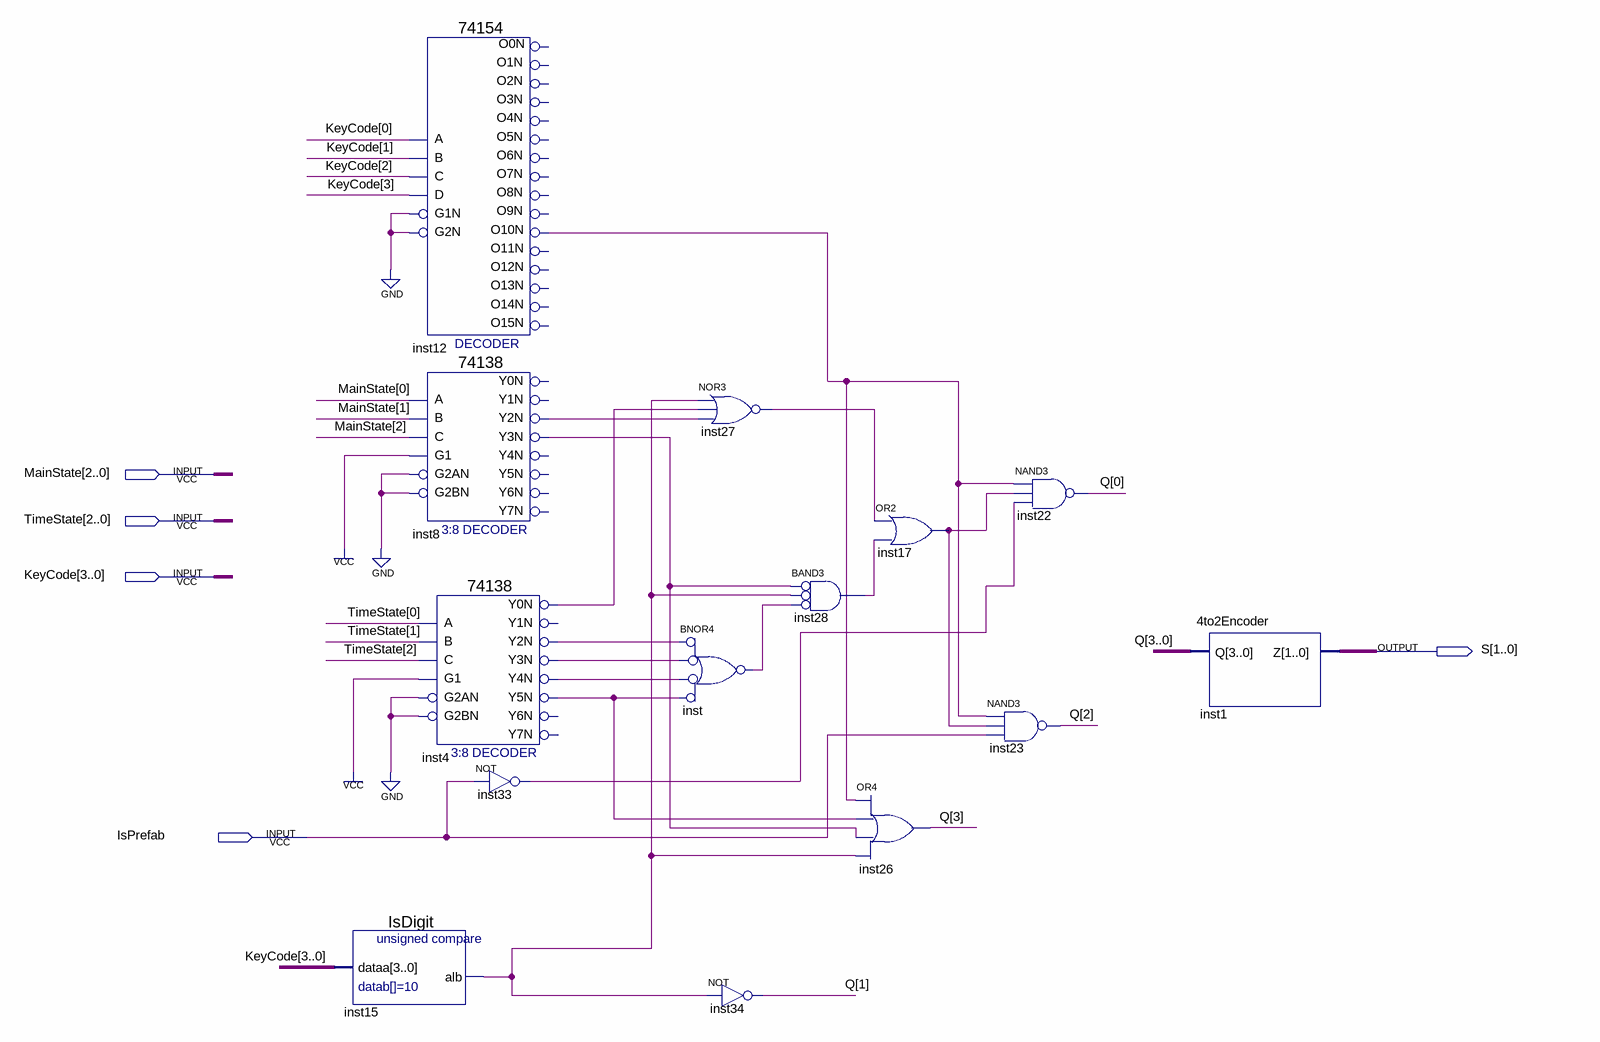
[diagram p0: schematic sheet]
// Quartus schematic TimeSourceSelector.bdf as structural Verilog: 14 symbols, 5 pins
module TimeSourceSelector (
  input  [2:0] MainState,
  input  [2:0] TimeState,
  input  [3:0] KeyCode,
  input  IsPrefab,
  output [1:0] S
);

  wire inst4_y0n, inst4_y2n, inst4_y3n, inst4_y4n, inst4_y5n, inst8_y2n, inst8_y3n, inst12_o10n, inst15_alb,
       inst17_out, inst27_out, inst28_out, inst33_out, inst_out;
  wire [3:0] Q;

  IsDigit inst15 (.dataa(KeyCode), .alb(inst15_alb));
  \74154  inst12 (
    .C(KeyCode[2]), .D(KeyCode[3]), .B(KeyCode[1]), .A(KeyCode[0]), .G1N(1'b0), .G2N(1'b0), .O10N(inst12_o10n));  // open: O0N, O12N, O15N, O11N, O1N, O13N, O14N, O4N, O3N, O2N, O7N, O6N, O5N, O9N, O8N
  \74138  inst8 (
    .A(MainState[0]), .B(MainState[1]), .G1(1'b1), .C(MainState[2]), .G2AN(1'b0), .G2BN(1'b0),
    .Y2N(inst8_y2n), .Y3N(inst8_y3n));  // open: Y0N, Y1N, Y4N, Y5N, Y6N, Y7N
  \74138  inst4 (
    .A(TimeState[0]), .B(TimeState[1]), .G1(1'b1), .C(TimeState[2]), .G2AN(1'b0), .G2BN(1'b0),
    .Y0N(inst4_y0n), .Y2N(inst4_y2n), .Y3N(inst4_y3n), .Y4N(inst4_y4n), .Y5N(inst4_y5n));  // open: Y1N, Y6N, Y7N
  not inst33 (inst33_out, IsPrefab);
  nor inst27 (inst27_out, inst15_alb, inst4_y0n, inst8_y2n);
  nor inst (inst_out, ~inst4_y2n, ~inst4_y3n, ~inst4_y4n, ~inst4_y5n);  // BNOR4
  not inst34 (Q[1], inst15_alb);
  and inst28 (inst28_out, ~inst8_y3n, ~inst15_alb, ~inst_out);  // BAND3
  or inst17 (inst17_out, inst27_out, inst28_out);
  or inst26 (Q[3], inst12_o10n, inst4_y5n, inst8_y3n, inst15_alb);
  nand inst22 (Q[0], inst12_o10n, inst17_out, inst33_out);
  nand inst23 (Q[2], inst12_o10n, inst17_out, IsPrefab);
  \4to2Encoder  inst1 (.Q(Q), .Z(S));
endmodule
